# Altium schematic sheet V3.0.SchDoc
size 96 x 50 mm
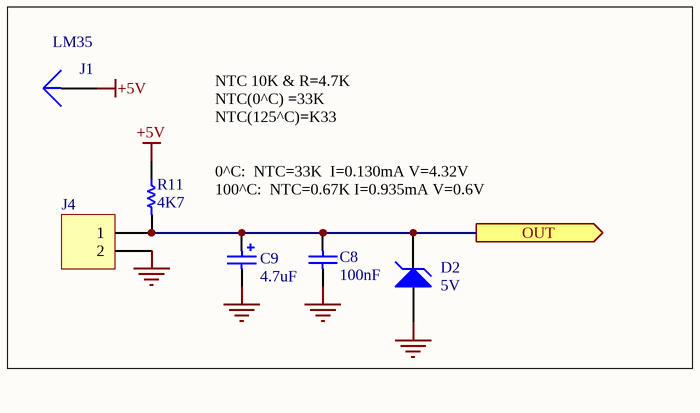
[diagram p0: V3.0.SchDoc]

## Parts
C8  100nF  [CAPNTO2.54-3.05x1.78A]
C9  4.7uF  [CAPPR2.5-6.3x5]
D2  5V  [DIODE0.4_Glass]
J1  COAX-M  [Fonics_1PIN_1]  (value not drawn)
J4  2PIN  [Fonics_2PIN_1]  (value not drawn)
R11  4K7  [AXIAL-0.4]

## Ports
OUT (out)

## Nets
+5V: J1.1(A) R11.1
GND: C8.1 C9.2 D2.1(A) J4.2
OUT: C8.2 C9.1 D2.2(K) J4.1 R11.2 ; port OUT

## Notes on the sheet
- (near J1) LM35
- NTC 10K & R=4.7K
  NTC(0^C) =33K
  NTC(125^C)=K33
  0^C: 	NTC=33K		I=0.130mA	V=4.32V
  100^C: 	NTC=0.67K	I=0.935mA	V=0.6V

## Library data of the parts
C8 = Cap: Capacitor; Manufacturer: Generic Components; Class I: Passive; Published: 8-Jun-2000; Revision: July-2002: Re-released for DXP Platform.; Publisher: Altium Limited; Class II: Capacitor
C9 = Cap Pol1: Polarized Capacitor (Radial); Manufacturer: Generic Components; Class I: Passive; Published: 8-Jun-2000; Revision: July-2002: Re-released for DXP Platform.; Publisher: Altium Limited; Class II: Capacitor
D2 = D Zener: Zener Diode; Manufacturer: Generic Components; Class I: Discrete; Class II: Diode - Zener; Published: 8-Jun-2000; Revision: July-2002: Re-released for DXP Platform.; Publisher: Altium Limited
J1 = COAX-M: Coax-M Connector; Manufacturer: Generic Components; Revision: July-2002: Re-released for DXP Platform.; Publisher: Altium Limited; Class I: Connector
J4 = Header 2: Header, 2-Pin; LatestRevisionDate: 17-Jul-2002; LatestRevisionNote: Re-released for DXP Platform.; Publisher: Altium Limited
R11 = Res1: Resistor; Published: 8-Jun-2000; LatestRevisionDate: 17-Jul-2002; LatestRevisionNote: Re-released for DXP Platform.; PackageReference: AXIAL-0.3; Publisher: Altium Limited